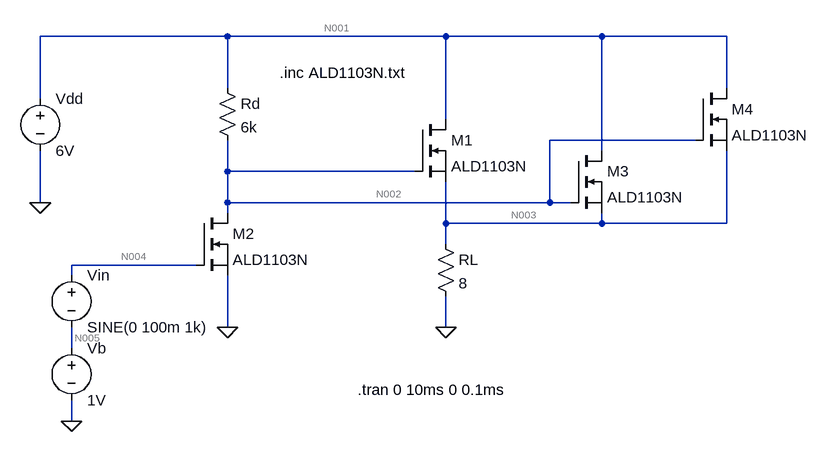
[diagram p0: schematic prelab 7.asc]
prelab 7.asc, the LTspice schematic file:
Version 4.1
SHEET 1 1208 680
WIRE 304 16 16 16
WIRE 640 16 304 16
WIRE 880 16 640 16
WIRE 1072 16 880 16
WIRE 304 96 304 16
WIRE 1072 96 1072 16
WIRE 16 112 16 16
WIRE 640 144 640 16
WIRE 1024 176 800 176
WIRE 880 192 880 16
WIRE 304 224 304 176
WIRE 592 224 304 224
WIRE 16 272 16 192
WIRE 304 272 304 224
WIRE 800 272 800 176
WIRE 800 272 304 272
WIRE 832 272 800 272
WIRE 304 288 304 272
WIRE 640 304 640 240
WIRE 880 304 880 288
WIRE 880 304 640 304
WIRE 1072 304 1072 192
WIRE 1072 304 880 304
WIRE 640 336 640 304
WIRE 256 368 64 368
WIRE 64 384 64 368
WIRE 304 464 304 384
WIRE 640 464 640 416
WIRE 64 496 64 464
WIRE 64 608 64 576
FLAG 16 272 0
FLAG 640 464 0
FLAG 304 464 0
FLAG 64 608 0
SYMBOL voltage 16 96 R0
WINDOW 123 0 0 Left 0
WINDOW 39 0 0 Left 0
SYMATTR InstName Vdd
SYMATTR Value 6V
SYMBOL res 288 80 R0
SYMATTR InstName Rd
SYMATTR Value 6k
SYMBOL res 624 320 R0
SYMATTR InstName RL
SYMATTR Value 8
SYMBOL nmos 592 144 R0
SYMATTR InstName M1
SYMATTR Value ALD1103N
SYMBOL nmos 256 288 R0
SYMATTR InstName M2
SYMATTR Value ALD1103N
SYMBOL voltage 64 368 R0
WINDOW 123 0 0 Left 0
WINDOW 39 0 0 Left 0
SYMATTR InstName Vin
SYMATTR Value SINE(0 100m 1k)
SYMBOL voltage 64 480 R0
WINDOW 123 0 0 Left 0
WINDOW 39 0 0 Left 0
SYMATTR InstName Vb
SYMATTR Value 1V
SYMBOL nmos 832 192 R0
SYMATTR InstName M3
SYMATTR Value ALD1103N
SYMBOL nmos 1024 96 R0
SYMATTR InstName M4
SYMATTR Value ALD1103N
TEXT 384 72 Left 2 !.inc ALD1103N.txt
TEXT 504 560 Left 2 !.tran 0 10ms 0 0.1ms

The netlist it stands for:
* prelab 7.asc
Vdd N001 0 6V
Rd N001 N002 6k
RL N003 0 8
M1 N001 N002 N003 N003 ALD1103N
M2 N002 N004 0 0 ALD1103N
Vin N004 N005 SINE(0 100m 1k)
Vb N005 0 1V
M3 N001 N002 N003 N003 ALD1103N
M4 N001 N002 N003 N003 ALD1103N
.model NMOS NMOS
.model PMOS PMOS
.lib standard.mos
.inc ALD1103N.txt
.tran 0 10ms 0 0.1ms
.backanno
.end

* Results of the author's LTspice run, read from the files saved beside the schematic
* Operating Point, zero values left out:
*   V(n002) = 3.235 V
*   V(n004) = 1 V
*   V(n005) = 1 V
*   V(n001) = 6 V
*   V(n003) = 348.8 mV
*   I(Vdd) = -44.06 mA
*   I(RL) = 43.6 mA
*   Id(M2) = 460.8 µA
*   Is(M2) = -460.8 µA
*   Ib(M2) = -3.245 pA
*   Id(M3) = 14.53 mA
*   Is(M3) = -14.53 mA
*   Ib(M3) = -5.665 pA
*   I(Rd) = 460.8 µA
*   Id(M1) = 14.53 mA
*   Is(M1) = -14.53 mA
*   Ib(M1) = -5.665 pA
*   Id(M4) = 14.53 mA
*   Is(M4) = -14.53 mA
*   Ib(M4) = -5.665 pA
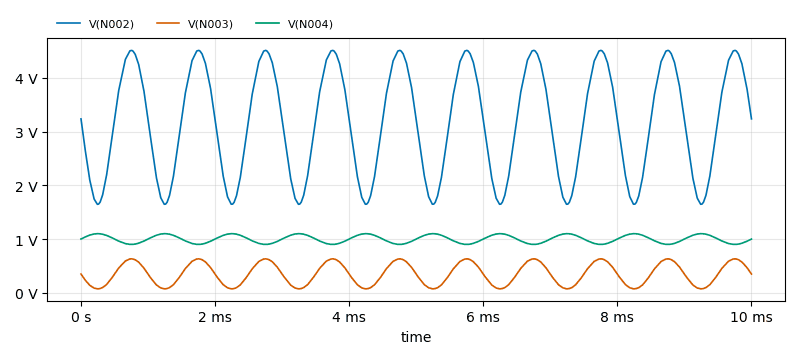
[diagram p1: Transient Analysis of prelab 7.asc, plotted from the saved traces]
* Transient Analysis, 1 run:
*   V(N002): min 1.646 V, max 4.51 V, average 3.153 V, rms 3.317 V, last 3.236 V
*   V(N003): min 74.46 mV, max 631.3 mV, average 350 mV, rms 404.4 mV, last 348.9 mV
*   V(N004): min 900.1 mV, max 1.1 V, average 1 V, rms 1.003 V, last 1 V